# Altium schematic sheet LEDChain2.SchDoc
size A; SheetNumber: 3; SheetTotal: 3
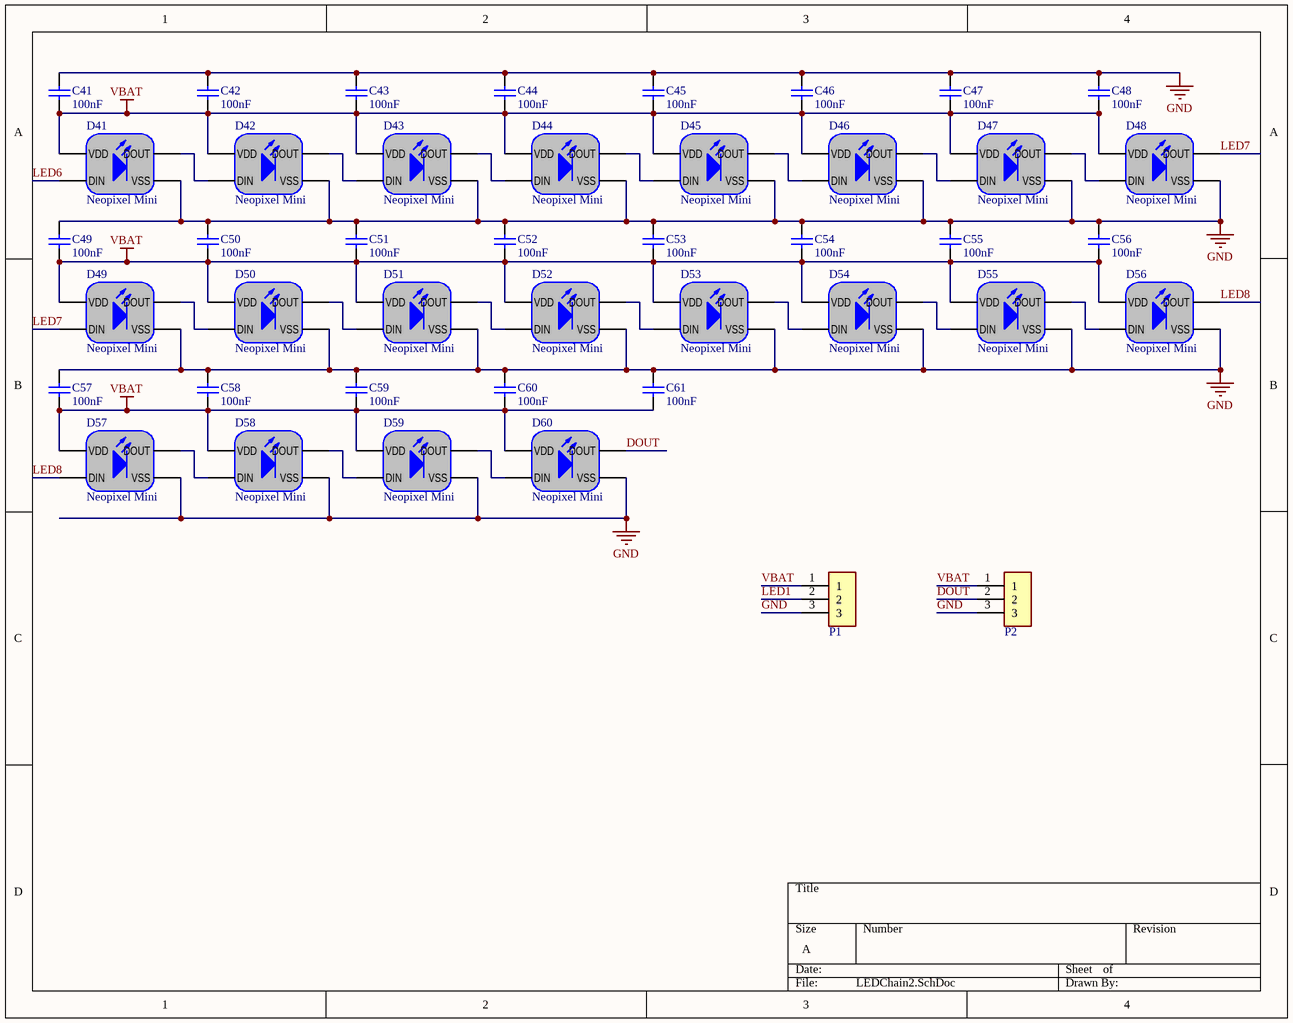
[diagram p0: LEDChain2.SchDoc]

## Parts
C41  100nF  [0402_CAP]
C42  100nF  [0402_CAP]
C43  100nF  [0402_CAP]
C44  100nF  [0402_CAP]
C45  100nF  [0402_CAP]
C46  100nF  [0402_CAP]
C47  100nF  [0402_CAP]
C48  100nF  [0402_CAP]
C49  100nF  [0402_CAP]
C50  100nF  [0402_CAP]
C51  100nF  [0402_CAP]
C52  100nF  [0402_CAP]
C53  100nF  [0402_CAP]
C54  100nF  [0402_CAP]
C55  100nF  [0402_CAP]
C56  100nF  [0402_CAP]
C57  100nF  [0402_CAP]
C58  100nF  [0402_CAP]
C59  100nF  [0402_CAP]
C60  100nF  [0402_CAP]
C61  100nF  [0402_CAP]
D41  Neopixel Mini  [SK6812 (3535)]
D42  Neopixel Mini  [SK6812 (3535)]
D43  Neopixel Mini  [SK6812 (3535)]
D44  Neopixel Mini  [SK6812 (3535)]
D45  Neopixel Mini  [SK6812 (3535)]
D46  Neopixel Mini  [SK6812 (3535)]
D47  Neopixel Mini  [SK6812 (3535)]
D48  Neopixel Mini  [SK6812 (3535)]
D49  Neopixel Mini  [SK6812 (3535)]
D50  Neopixel Mini  [SK6812 (3535)]
D51  Neopixel Mini  [SK6812 (3535)]
D52  Neopixel Mini  [SK6812 (3535)]
D53  Neopixel Mini  [SK6812 (3535)]
D54  Neopixel Mini  [SK6812 (3535)]
D55  Neopixel Mini  [SK6812 (3535)]
D56  Neopixel Mini  [SK6812 (3535)]
D57  Neopixel Mini  [SK6812 (3535)]
D58  Neopixel Mini  [SK6812 (3535)]
D59  Neopixel Mini  [SK6812 (3535)]
D60  Neopixel Mini  [SK6812 (3535)]
P1  HEADER_1x3_TIGHT  [PIN3 - TIGHT]  (value not drawn)
P2  HEADER_1x3_TIGHT  [PIN3 - TIGHT]  (value not drawn)

## Nets
GND: C41.2 C42.2 C43.2 C44.2 C45.2 C46.2 C47.2 C48.2 C49.2 C50.2 C51.2 C52.2 C53.2 C54.2 C55.2 C56.2 C57.2 C58.2 C59.2 C60.2 C61.2 D41.2(VSS) D42.2(VSS) D43.2(VSS) D44.2(VSS) D45.2(VSS) D46.2(VSS) D47.2(VSS) D48.2(VSS) D49.2(VSS) D50.2(VSS) D51.2(VSS) D52.2(VSS) D53.2(VSS) D54.2(VSS) D55.2(VSS) D56.2(VSS) D57.2(VSS) D58.2(VSS) D59.2(VSS) D60.2(VSS) P1.3 P2.3
VBAT: C41.1 C42.1 C43.1 C44.1 C45.1 C46.1 C47.1 C48.1 C49.1 C50.1 C51.1 C52.1 C53.1 C54.1 C55.1 C56.1 C57.1 C58.1 C59.1 C60.1 C61.1 D41.4(VDD) D42.4(VDD) D43.4(VDD) D44.4(VDD) D45.4(VDD) D46.4(VDD) D47.4(VDD) D48.4(VDD) D49.4(VDD) D50.4(VDD) D51.4(VDD) D52.4(VDD) D53.4(VDD) D54.4(VDD) D55.4(VDD) D56.4(VDD) D57.4(VDD) D58.4(VDD) D59.4(VDD) D60.4(VDD) P1.1 P2.1
DOUT: D60.1(DOUT) P2.2
LED1: P1.2
LED6: D41.3(DIN)
LED7: D48.1(DOUT) D49.3(DIN)
LED8: D56.1(DOUT) D57.3(DIN)
NetD41_1: D41.1(DOUT) D42.3(DIN)
NetD42_1: D42.1(DOUT) D43.3(DIN)
NetD43_1: D43.1(DOUT) D44.3(DIN)
NetD44_1: D44.1(DOUT) D45.3(DIN)
NetD45_1: D45.1(DOUT) D46.3(DIN)
NetD46_1: D46.1(DOUT) D47.3(DIN)
NetD47_1: D47.1(DOUT) D48.3(DIN)
NetD49_1: D49.1(DOUT) D50.3(DIN)
NetD50_1: D50.1(DOUT) D51.3(DIN)
NetD51_1: D51.1(DOUT) D52.3(DIN)
NetD52_1: D52.1(DOUT) D53.3(DIN)
NetD53_1: D53.1(DOUT) D54.3(DIN)
NetD54_1: D54.1(DOUT) D55.3(DIN)
NetD55_1: D55.1(DOUT) D56.3(DIN)
NetD57_1: D57.1(DOUT) D58.3(DIN)
NetD58_1: D58.1(DOUT) D59.3(DIN)
NetD59_1: D59.1(DOUT) D60.3(DIN)

## Library data of the parts
C41-C61 = CAP_100N_0603: CAP CER 0.1UF 16V X7R 0402; Published: 8-Jun-2000; LatestRevisionDate: 17-Jul-2002; LatestRevisionNote: Re-released for DXP Platform.; Publisher: Altium Limited; PackageDescription: Radial Cap, Thru-Hole; 2 Leads; 0.3 in Pin Spacing; PackageReference: RAD-0.3; Supplier 1: Digi-Key; Supplier Part Number 1: 587-1451-1-ND
D41-D60 = SK6812MINI-B-001: ADDRESS LED DISC SERIAL RGB; Supplier 1: Digi-Key; Supplier Part Number 1: 1528-1541-ND